# EAGLE design Erls MCP73871 Solar Charger v1 (EAGLE 6.4)
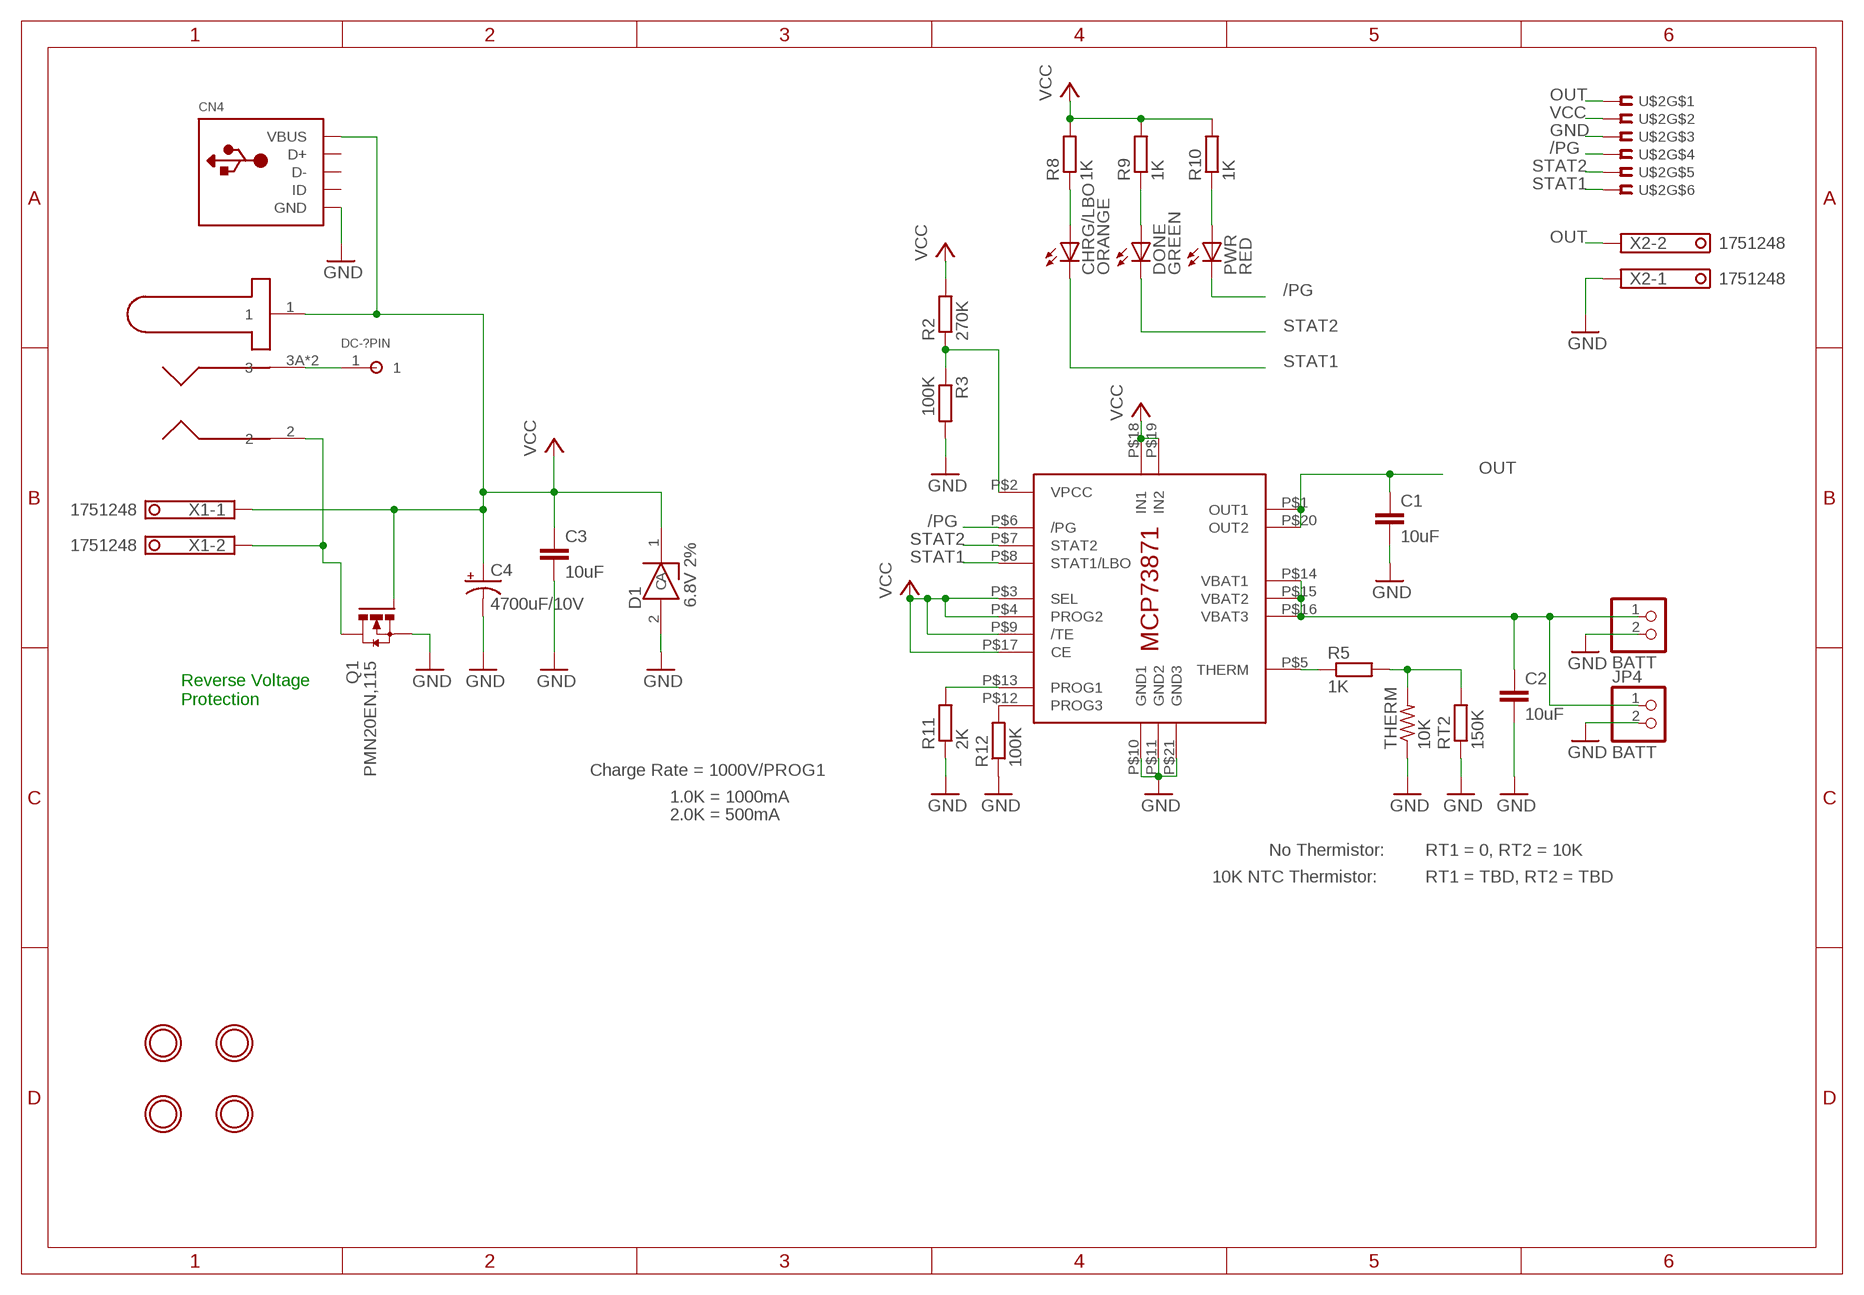
[diagram p0: schematic, sheet 1]

## Parts
BATT  JST_2PIN-SMT-RA  [JST-PH-2-SMT-RA]
C1  10uF  C-EUC0603K  [C0603K]
C2  10uF  C-EUC0603K  [C0603K]
C3  10uF  C-EUC0603K  [C0603K]
C4  4700uF/10V  CPOL-USE5-13  [E5-13]
CHRG/LBO  ORANGE  LED-0603  [CHIPLED_0603]
CN4  USB-MINIB-ONSHORE-M26FTR  [USB-MINIB-ONSHORE-M26FTR]
D1  6.8V 2%  ZENER-MM3Z6V8ST1G  [SOD323]
DC-?PIN  PAD-1-TH  [PAD-1-TH]
DONE  GREEN  LED-0603  [CHIPLED_0603]
JP4  BATT  HEADER-1X2ROUND  [1X02_ROUND]
PWR  RED  LED-0603  [CHIPLED_0603]
Q1  PMN20EN,115  [SOT457R_PHILIPS]
R2  270K  R-EU_R0603  [R0603]
R3  100K  R-EU_R0603  [R0603]
R5  1K  R-EU_R0603  [R0603]
R8  1K  R-EU_R0603  [R0603]
R9  1K  R-EU_R0603  [R0603]
R10  1K  R-EU_R0603  [R0603]
R11  2K  R-EU_R0603  [R0603]
R12  100K  R-EU_R0603  [R0603]
RT2  150K  R-EU_R0603  [R0603]
THERM  10K  R-US_FLIPFLOP  [0805-THM]
U1  MCP73871  [QFN20_4MM]
U$1  DJACK-NOSW-CUI-PJ028-SMT  [DCJACK-CUI-PJ028-SMT]
U$2  FE06-1W-MOLEX-KK-22-15-2026  [MOLEX-KK-22-15-2026-6]
U$4  MOUNTINGHOLE2.5  [MOUNTINGHOLE_2.5_PLATED]
U$5  MOUNTINGHOLE2.5  [MOUNTINGHOLE_2.5_PLATED]
U$6  MOUNTINGHOLE2.5  [MOUNTINGHOLE_2.5_PLATED]
U$7  MOUNTINGHOLE2.5  [MOUNTINGHOLE_2.5_PLATED]
X1  1751248  [1751248]
X2  1751248  [1751248]

## Nets
/PG: PWR.C U1.P$6(/PG) U$2.4
BATT: BATT.1 C2.1 JP4.1 U1.P$14(VBAT1) U1.P$15(VBAT2) U1.P$16(VBAT3)
DC-?PIN: DC-?PIN.1 U$1.3A U$1.3B
GND: BATT.2 C1.2 C2.2 C3.2 C4.- CN4.5(GND) D1.2(A) JP4.2 Q1.4(S) R3.2 R11.1 R12.1 RT2.1 THERM.1 U1.P$10(GND1) U1.P$11(GND2) U1.P$21(GND3) U$2.3 X2.1
INGND: Q1.1(D) Q1.2(D) Q1.5(D) Q1.6(D) U$1.2 X1.2
N$8: R5.2 RT2.2 THERM.2
N$12: CHRG/LBO.A R8.1
N$13: DONE.A R9.1
N$14: PWR.A R10.1
N$15: R12.2 U1.P$12(PROG3)
N$16: R11.2 U1.P$13(PROG1)
OUT: C1.1 U1.P$1(OUT1) U1.P$20(OUT2) U$2.1 X2.2
STAT1: CHRG/LBO.C U1.P$8(STAT1/LBO) U$2.6
STAT2: DONE.C U1.P$7(STAT2) U$2.5
THERM: R5.1 U1.P$5(THERM)
VCC: C3.1 C4.+ CN4.1(VBUS) D1.1(C) Q1.3(G) R2.2 R8.2 R9.2 R10.2 U1.P$3(SEL) U1.P$4(PROG2) U1.P$9(/TE) U1.P$17(CE) U1.P$18(IN1) U1.P$19(IN2) U$1.1 U$2.2 X1.1
VPCC: R2.1 R3.1 U1.P$2(VPCC)
Unconnected: CN4.2(D-) CN4.3(D+) CN4.4(ID)

## Notes on the sheet
- Reverse Voltage 
  Protection
- Charge Rate = 1000V/PROG1
- 1.0K = 1000mA
- 2.0K = 500mA
- No Thermistor: | RT1 = 0, RT2 = 10K
- 10K NTC Thermistor: | RT1 = TBD, RT2 = TBD

## Library data of the parts
BATT = adafruit:JST_2PIN: JST 2-Pin Connectors of various flavors SMT-RA (S2B-PH-SM4) 4UConnector #17311 SMT (B2B-PH-SM4) THM-RA (S2B-PH) THM (B2B-PH)
C1-C3 = Erland's Library:C-EU: CAPACITOR, European symbol
C4 = adafruit:CPOL-US: POLARIZED CAPACITOR, American symbol
CHRG/LBO DONE PWR = Erland's Library:LED
CN4 = Erland's Library:USB: USB Connectors USBMINIB - Surface Mount Female Mini-B USB Connector 4UConnector: 06564 By microbuilder.eu Thru-hole RA Female Mini-B USB Connector 4UConnector: 18732 By ladyada.net
D1 = Erland's Library:ZENER
DC-?PIN = Erland's Library:PAD-1
JP4 = microbuilder:HEADER-1X2: PIN HEADER
Q1 = Erland's Library:PMN20EN
R2 R3 R5 R8-R12 RT2 = Erland's Library:R-EU_: RESISTOR, European symbol
THERM = adafruit:R-US_: RESISTOR, American symbol
U1 = adafruit:MCP73871
U$1 = Erland's Library:DJACK-NOSW
U$2 = Erland's Library:FE06-1W
U$4-U$7 = microbuilder:MOUNTINGHOLE: Mounting Hole For #2 screws (0.086"/2.18mm width, 0.094"/2.4mm hole) use 2.5mm
X1 X2 = con-phoenix-350:1751248: MKDS 1/ 2-3,5 Printklemme Nennstrom: 10 A Bemessungsspannung: 160 V Raster: 3,5 mm Polzahl: 2 Montageart: Löten Anschlussart: Schraubanschluss Anschlussrichtung vom Leiter zur Platine: 0° Source: http://eshop.phoenixcontact.com .. 1751248.pdf; OC_FARNELL: unknown; OC_NEWARK: unknown

## Board
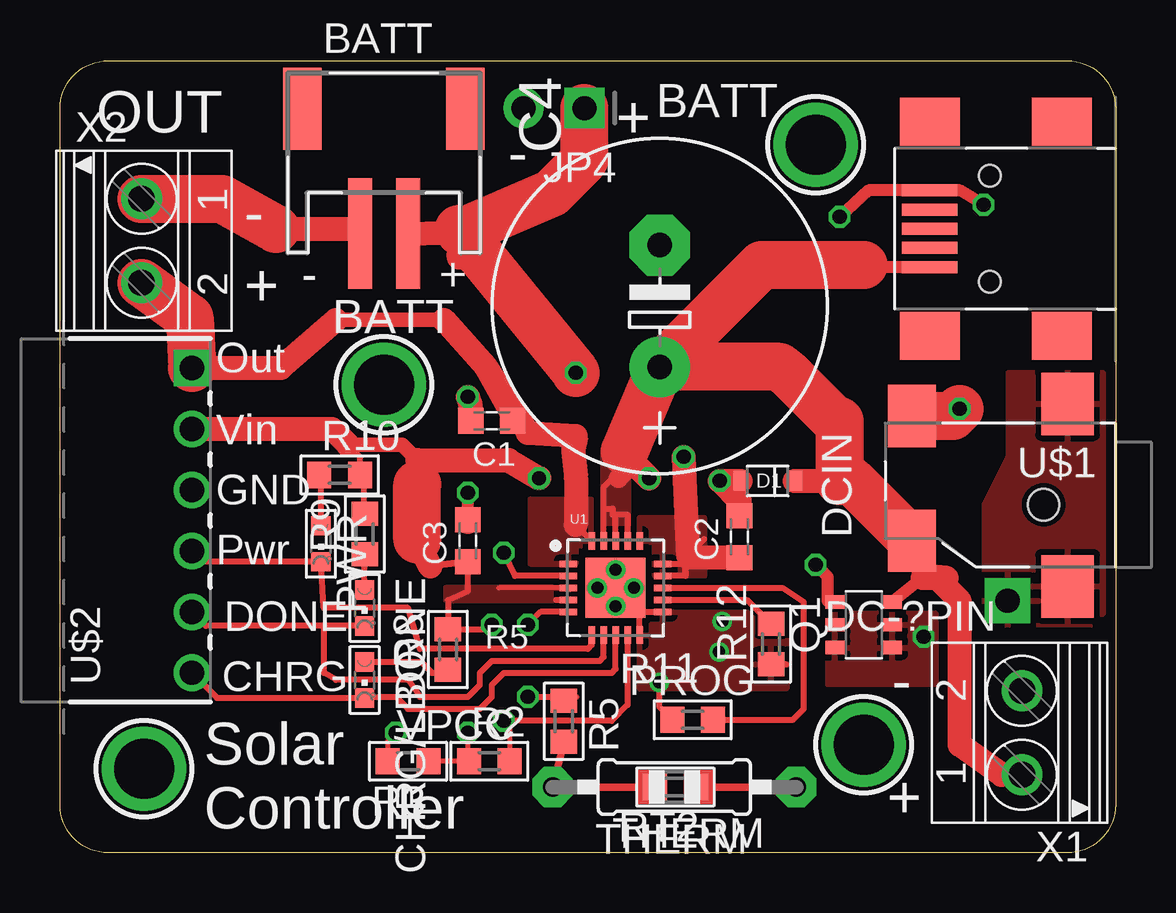
[diagram p1: board, top side]
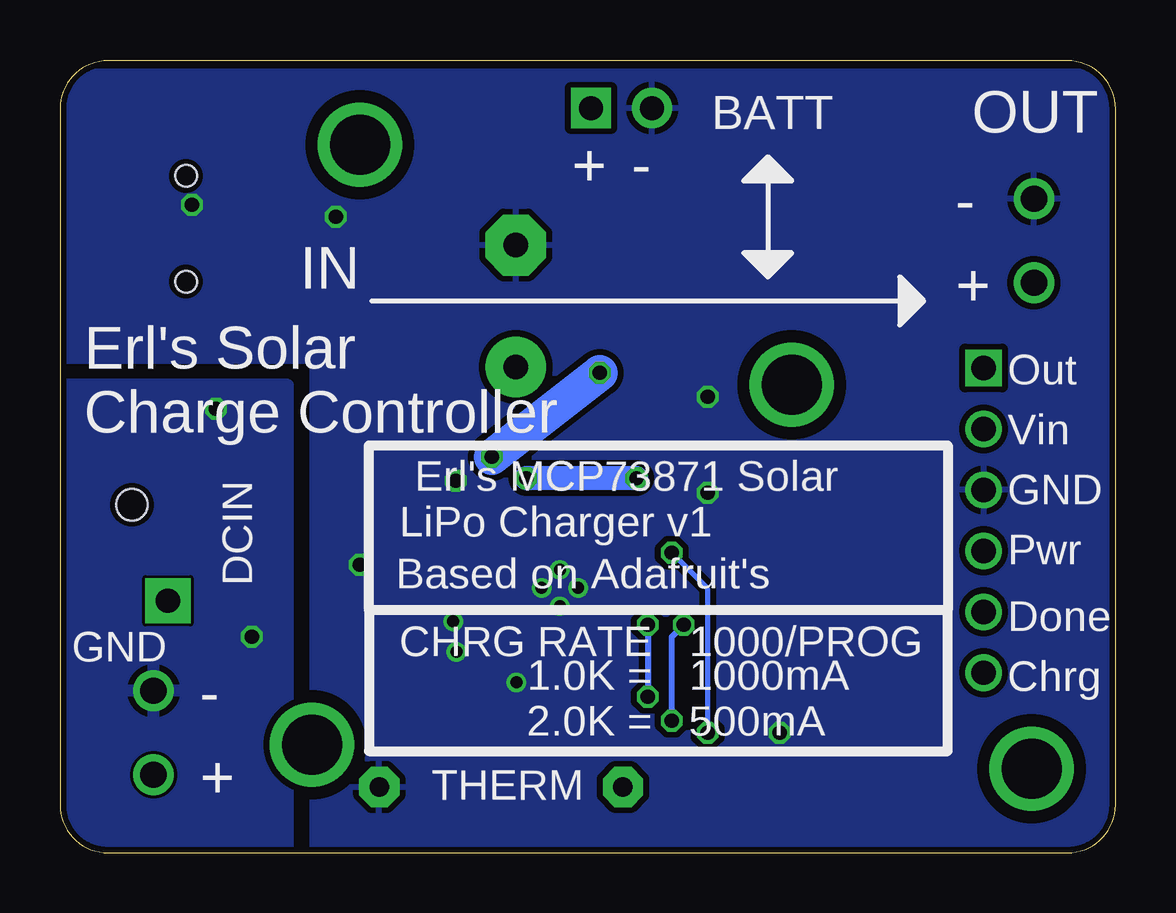
[diagram p2: board, bottom side, seen from below]

Size 44 x 33 mm. Coordinates in mm from the lower left corner, seen from the top.
Outline: 0,2 0,31 arc-90 2,33 42,33 arc-90 44,31 44,2 arc-90 42,0 2,0 arc-90 0,2
Copper layers (1*16): Top 0.035mm / dielectric 1.5mm / Bottom 0.035mm
Design rules "dirt_cheap_dirty_boards.v1": minimum track width 5mil, minimum drill 12mil, track to track 5mil, track to pad 5mil, pad to pad 5mil, via to via 5mil, smd to smd 0mil, copper to edge 10mil, drill to drill 10mil, minimum pad ring 10mil, minimum via ring 6mil, stop-mask expansion 2mil, vias tented up to drill 25mil, thermal gap 10mil
tRestrict: area 21,10.7 to 21.4,10.8; 9 lines

### Footprints (pad centres in the part's own frame; a part is rotated, then mirrored left to right if it is on the bottom)
JST-PH-2-SMT-RA = smd 1 x 4.6: 1 1,-3.7; 2 -1,-3.7 | smd 1.6 x 3.4: NC1 -3.4,1.5; NC2 3.4,1.5
C0603K = smd 1.05 x 1.08: 1 -0.875,0; 2 0.875,0
E5-13 = drill 1.016 pad 2.54: + -2.54,0 | drill 1.016 pad 2.54 octagon: - 2.54,0
CHIPLED_0603 = smd 0.8 x 0.8: A 0,-0.75; C 0,0.75
USB-MINIB-ONSHORE-M26FTR = smd 0.5 x 2.3: 1 -1.6,2.5; 2 -0.8,2.5; 3 0,2.5; 4 0.8,2.5; 5 1.6,2.5 | smd 2 x 2.5: P$1 -4.45,2.5; P$2 -4.45,-3; P$3 4.45,2.5; P$4 4.45,-3 | hole 0.9: -2.2,0; 2.2,0
SOD323 = smd 0.63 x 0.83: 1 -1.115,0; 2 1.115,0
PAD-1-TH = drill 1.016 pad 1.88 square: 1 0,0
1X02_ROUND = drill 1 pad 1.676 square: 1 -1.27,0 | drill 1 pad 1.676: 2 1.27,0
SOT457R_PHILIPS = smd 0.55 x 0.8: 1 -0.95,-1.2; 2 0,-1.2; 3 0.95,-1.2; 4 0.95,1.2; 5 0,1.2; 6 -0.95,1.2
R0603 = smd 1 x 1.1: 1 -0.85,0; 2 0.85,0
0805-THM = drill 0.813 pad 1.676 octagon: 1 -5.08,0; 2 5.08,0
QFN20_4MM = smd 0.73 x 0.28: P$1 -1.965,1; P$2 -1.965,0.5; P$3 -1.965,0; P$4 -1.965,-0.5; P$5 -1.965,-1; P$11 1.965,-1; P$12 1.965,-0.5; P$13 1.965,0; P$14 1.965,0.5; P$15 1.965,1 | smd 0.28 x 0.73: P$6 -1,-1.965; P$7 -0.5,-1.965; P$8 0,-1.965; P$9 0.5,-1.965; P$10 1,-1.965; P$16 1,1.965; P$17 0.5,1.965; P$18 0,1.965; P$19 -0.5,1.965; P$20 -1,1.965 | smd 2.5 x 2.5: P$21 0,0
DCJACK-CUI-PJ028-SMT = smd 2 x 2.6: 1 8.5,1.5; 2 8.5,-3.7 | smd 2.2 x 2.6: 3A 2,3.4; 3B 2,-4.2 | hole 1.3: 3,0
MOLEX-KK-22-15-2026-6 = drill 1.016 square: 1 12.7,0 | drill 1.016: 2 10.16,0; 3 7.62,0; 4 5.08,0; 5 2.54,0; 6 0,0
MOUNTINGHOLE_2.5_PLATED = drill 2.5 pad 3.2: P$1 0,0
1751248 = drill 1.1 pad 1.7: 1 -1.75,-0.1; 2 1.75,-0.1

### Placement (x,y rotation side)
BATT  13.5,29.5 0 top
C1  18,18 180 top
C2  28.33,13.17 90 top
C3  17,13 90 top
C4  25,22.78 90 top
CHRG/LBO  12.7,7.2 180 top
CN4  38.75,26 90 top
D1  29.5,15.5 180 top
DC-?PIN  39.5,10.5 0 top
DONE  12.7,10.2 180 top
JP4  20.59,31.03 180 top
PWR  10.88,12.87 180 top
Q1  33.5,9.5 90 top
R2  17.9,3.81 0 top
R3  14.51,3.81 180 top
R5  21,5.48 270 top
R8  16.17,8.47 90 top
R9  12.7,13.28 90 top
R10  11.66,15.75 0 top
R11  26.38,5.54 0 top
R12  29.64,8.7 90 top
RT2  25.65,2.74 180 top
THERM  25.61,2.74 180 top
U1  23.16,11.03 0 top
U$1  44,14.5 180 top
U$2  5.5,7.5 90 top
U$4  3.5,3.5 0 top
U$5  33.5,4.5 0 top
U$6  13.5,19.5 0 top
U$7  31.5,29.5 0 top
X1  40,5 90 top
X2  3.5,25.5 270 top

### Tracks (layer width: path | path; a pad name or v marks a point on that pad's centre or on a via)
/PG
  Top 0.254: U1.P$6 22.16,8.66 22,8.5 15,8.5 14.5,10.2 11,10.2 PWR.C 5.96,12.12 U$2.4
BATT  (via drill 0.6)
  Top 0.254: 26.08,12.94 26.08,13.19 | 26.07,11.53 U1.P$14 | 26.07,11.53 26.08,11.54 26.08,12.05 25.14,12.05 U1.P$15 | 26.07,11.53 26.07,12.3 26.84,13.07
  Top 1: BATT.1 16.68,25.86 16.62,24.79 16.62,26 | C2.1 26.21,12.29 v26,16.5
  Top 2: 16.62,26 v21.5,20 | 16.68,25.86 20.5,27.5 21.86,28.86 JP4.1
  Bottom 1.5: v21.5,20 v26,16.5
  pour Top: 24.18,12.94 24.18,13.95 26.84,13.95 26.84,11.54 24.81,11.54 24.81,12.94
DC-?PIN
  pour Top: 39.5,20 39.5,16.5 38.5,14.5 38.5,9.5 43,9.5 43.5,10 43.5,20
GND  (via drill 0.5, 0.6)
  Top 0.2: v14,5 13.66,4.66 R3.2
  Top 0.254: 24.16,10.03 U1.P$11 | U1.P$10 24.16,10 | 24.16,10 24.18,10.02 | 24.16,10 23.89,10.27 v23.16,10.27 | 30.26,7.85 R12.1 | v24.98,7.1 24.98,6.09 R11.1 | RT2.1 THERM.1
  Top 0.406: U1.P$21 v23.92,11.03
  Top 0.5: Q1.4 32.05,10.45 32,10.5 32,11.5 v31.5,12 | v38.5,27 37.5,27.6 CN4.5 33.7,27.6 v32.5,26.5 | 17,13.78 v17,15
  Top 1: D1.2 v27.5,15.5 28.33,14.67 C2.2 | C1.2 17.12,18.62 v17,19 | 9,26 12.31,26 BATT.2 | C3.2 17,13.78
  Top 2: X2.1 6.75,27.25 9,26
  other vias: 27.48,8.37 27.61,9.64 23.16,11.8 22.4,11.03
  pour Bottom (isolate 0.254): 0,0 0,32.55 44.18,32.55 44,20.5 33.5,20.5 33.5,0
  pour Top: 24.18,10.02 30.27,10.02 30.27,6.84 24.18,6.84
INGND  (via drill 0.6)
  Top 2: U$1.2 37.2,18.2 v37.5,18.5
  other vias: 36,9
  pour Bottom: 34.5,0 34.5,19.5 44,19.5 44,0
  pour Top: 32,10 36.5,10 36.5,7 32,7
N$8
  Top 0.2: 21.03,4.6 R5.2
  Top 0.254: RT2.2 THERM.2 | 21.03,4.46 R5.2
  Top 0.3: THERM.2 21.03,4.6
N$12
  Top 0.254: CHRG/LBO.A 15.04,7.96 15.5,7.5 16.05,7.5 R8.1
N$13
  Top 0.254: R9.1 12.66,11.58 DONE.A
N$14
  Top 0.254: PWR.A 10.88,15.68 R10.1
N$15
  Top 0.254: U1.P$12 28.63,10.53 29.46,9.7 R12.2
N$16
  Top 0.254: U1.P$13 26.59,11.03 30.1,11.04 31,10.44 31,6 30.54,5.54 R11.2
OUT
  Top 0.254: U1.P$20 21.51,13.65 | C1.1 19,18
  Top 0.6: 11.5,22.2 16,22.2
  Top 1: 21.51,13.65 21.51,15.64 21.39,16.76 21.5,17.38 19.5,17.5 17.75,20.25 | U$2.1 9.2,20.2 11.5,22.2 | 16,22.2 17.75,20.25 | 19,18 17.75,20.25
  Top 2: X2.2 5.4,22.3 U$2.1
  pour Top: 22.14,12.81 22.14,14.72 19.61,14.72 19.61,12.05 21.51,12.05 21.51,12.81
STAT1
  Top 0.254: U1.P$8 23.16,7.66 23,7.5 18.5,7.5 18,7 18,6.5 17.5,6 14.5,6 14,6.5 13.41,6.5 CHRG/LBO.C 6.54,6.46 U$2.6
STAT2
  Top 0.254: DONE.C 11,9.46 | 11,9.46 6.08,9.46 U$2.5 | U1.P$7 22.66,8.16 22.5,8 18,8 17.5,7.5 17.5,7 17,6.5 15,6.5 14.5,7.2 11.5,7.2 11,7.5 11,9.46
THERM  (via drill 0.6)
  Top 0.254: U1.P$5 20.03,10.03 v19.5,9.5 | v19.5,6.5 21.53,6.5 R5.1
  Bottom 0.254: v19.5,9.5 v19.5,6.5
VCC  (via drill 0.6)
  Top 0.2: v18.5,5.5 18.75,5.25 R2.2 | U1.P$3 18.29,11.03
  Top 0.254: 23.03,14.08 23.03,14.34 22.66,14.34 U1.P$19 22.66,15.23 23.03,15.61 23.29,15.61 | U1.P$18 23.16,14.08 23.67,14.08 U1.P$17 | 20.7,10.53 U1.P$4 | 14.89,15.34 14.91,16.36 | C3.1 17,10.9 16.17,10.52 R8.2 17.82,9.32 v18,9.5 | R9.2 12.66,15.6 R10.2 12.51,16.49 12,17 | U1.P$9 23.66,6.16 23,5.5 v18.5,5.5
  Top 0.3: C3.1 15.44,11.94
  Top 0.5: 32.5,18 32.32,18 | CN4.1 32.5,24.4 33.5,24.5 | Q1.3 35.95,11.45 36,11.5 | 36,12.5 U$1.1
  Top 0.6: 12,17 14.27,17 14.91,16.36
  Top 0.813: 23.55,16.74 23.92,16.24 23.29,15.61
  Top 1: 14.91,16.36 18.71,16.36 v19.97,15.61 | 15.44,11.94 14.89,13.06 | D1.1 32.5,15.5 | U$2.2 11.34,17.66 12,17 | X1.1 39.25,3.25 37.5,4.5 37.5,10.5 36.5,11.5 36.95,11.45 35.95,11.45 | 36,11.5 36,12.5
  Top 1.016: v24.56,15.61 23.55,16.61 23.55,16.74
  Top 2: 14.89,13.06 14.89,15.34 | C4.+ 29.26,24.5 33.5,24.5 | 32.5,18 32.5,15.5 33,15.5 U$1.1 | 32.32,18 30.32,20 30,20.24 C4.+ | 23.55,16.74 25.04,20.23 C4.+
  Bottom 0.254: v18.5,5.5 18.5,9 v18,9.5
  Bottom 1: v19.97,15.61 v24.56,15.61
  pour Top: 22.65,12.88 22.65,16.75 23.67,16.75 23.67,12.88
  pour Top: 21.26,11.03 16.09,11.03 16.09,10.53 21.26,10.53
VPCC  (via drill 0.6)
  Top 0.2: v17,5 17,3.86 R2.1 R3.1
  Top 0.254: U1.P$2 18.97,11.53 v18.5,12.5
  Bottom 0.2: v17,5 17,11 v18.5,12.5

### Text on the board
tPlace: BATT | OUT | + | - | - | + | BATT | Out | DCIN | Vin | GND | Pwr | DONE | R5 | CHRG | PROG | - | VPCC | Solar / Controller | + | THERM
bPlace: OUT | BATT | - | + | - | + | IN | Out | Vin | Erl's Solar / Charge Controller | DCIN | GND | Erl's MCP73871 Solar | LiPo Charger v1 | Pwr | Based on Adafruit's | Done | 1000/PROG | CHRG RATE | GND | Chrg | 1000mA | 1.0K = | - | 500mA | 2.0K = | THERM | +